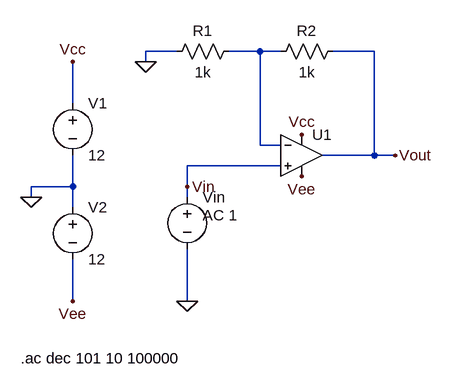
[diagram p0: schematic p6_prev1.asc]
p6_prev1.asc, the LTspice schematic file:
Version 4
SHEET 1 880 680
WIRE 272 16 224 16
WIRE 400 16 352 16
WIRE 432 16 400 16
WIRE 576 16 512 16
WIRE 224 32 224 16
WIRE 112 96 112 32
WIRE 400 160 400 16
WIRE 432 160 400 160
WIRE 576 176 576 16
WIRE 576 176 496 176
WIRE 608 176 576 176
WIRE 432 192 288 192
WIRE 112 224 112 176
WIRE 112 224 48 224
WIRE 288 224 288 192
WIRE 48 240 48 224
WIRE 288 240 288 224
WIRE 112 256 112 224
WIRE 112 400 112 336
WIRE 288 400 288 320
FLAG 48 240 0
FLAG 288 400 0
FLAG 224 32 0
FLAG 112 32 Vcc
FLAG 112 400 Vee
FLAG 464 144 Vcc
FLAG 464 208 Vee
FLAG 608 176 Vout
FLAG 288 224 Vin
SYMBOL voltage 112 80 R0
WINDOW 123 0 0 Left 0
WINDOW 39 0 0 Left 0
SYMATTR InstName V1
SYMATTR Value 12
SYMBOL voltage 112 240 R0
WINDOW 123 0 0 Left 0
WINDOW 39 0 0 Left 0
SYMATTR InstName V2
SYMATTR Value 12
SYMBOL voltage 288 224 R0
WINDOW 3 24 152 Left 2
WINDOW 123 24 44 Left 2
WINDOW 39 0 0 Left 0
SYMATTR Value ""
SYMATTR Value2 AC 1
SYMATTR InstName Vin
SYMBOL res 368 0 R90
WINDOW 0 0 56 VBottom 2
WINDOW 3 32 56 VTop 2
SYMATTR InstName R1
SYMATTR Value 1k
SYMBOL res 528 0 R90
WINDOW 0 0 56 VBottom 2
WINDOW 3 32 56 VTop 2
SYMATTR InstName R2
SYMATTR Value 1k
SYMBOL OpAmps\\UniversalOpamp2 464 176 R0
SYMATTR InstName U1
TEXT 32 488 Left 2 !.ac dec 101 10 100000

The netlist it stands for:
* p6_prev1.asc
V1 Vcc 0 12
V2 0 Vee 12
Vin Vin 0 AC 1
R1 N001 0 1k
R2 Vout N001 1k
XU1 Vin N001 Vcc Vee Vout level.2 Avol=1Meg GBW=10Meg Slew=10Meg ilimit=25m rail=0 Vos=0 phimargin=45 en=0 enk=0 in=0 ink=0 Rin=500Meg  ; pins IN+ IN- V+ V- OUT
.ac dec 101 10 100000
.lib UniversalOpamps2.sub
.backanno
.end

* Results of the author's LTspice run, read from the files saved beside the schematic
* Operating Point, zero values left out:
*   V(vcc) = 12 V
*   V(vee) = -12 V
*   I(V2) = -1.199 mA
*   I(V1) = -1.199 mA
*   Ix(u1:3) = 1.199 mA
*   Ix(u1:4) = -1.199 mA